# EAGLE design MXCHipConnector (EAGLE 9.3.2)
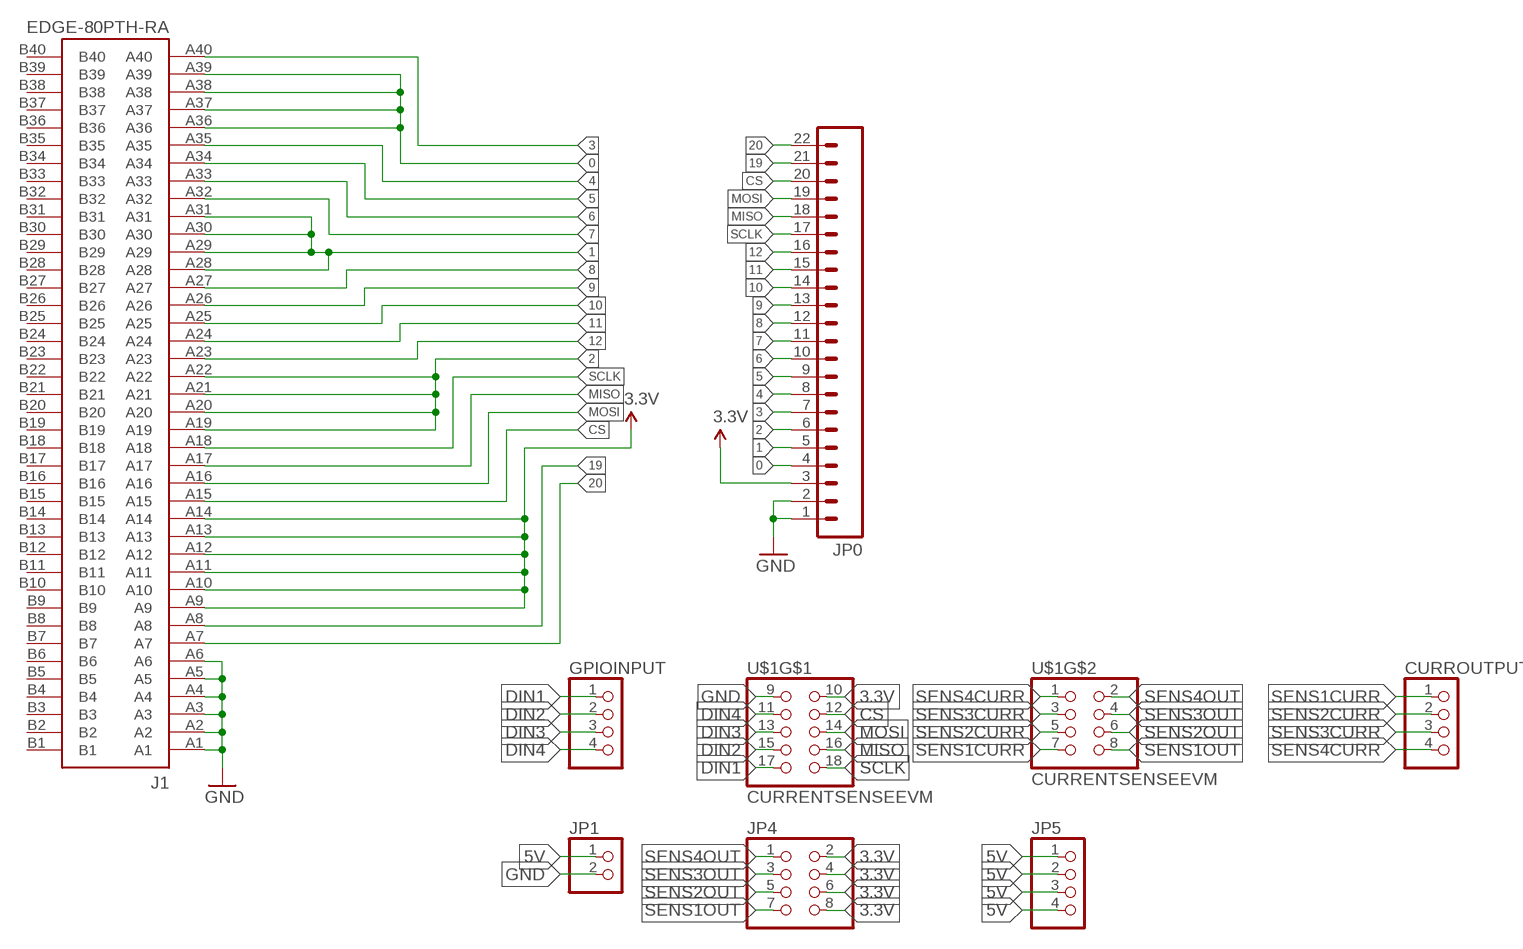
[diagram p0: schematic, sheet 1]

## Parts
CURROUTPUT  PINHD-1X4  [1X04]
GPIOINPUT  PINHD-1X4  [1X04]
J1  EDGE-80PTH-RA  [VEC-127-080-R]
JP0  M22PTH  [1X22]
JP1  PINHD-1X2  [1X02]
JP4  PINHD-2X4  [2X04]
JP5  PINHD-1X4  [1X04]
U$1  CURRENTSENSEEVM  [CURRENTSENSEEVM]

## Nets
0: J1.A36 J1.A37 J1.A38 J1.A39 JP0.4
1: J1.A28 J1.A29 J1.A30 J1.A31 JP0.5
2: J1.A19 J1.A20 J1.A21 J1.A22 JP0.6
3: J1.A40 JP0.7
3.3V: J1.A9 J1.A10 J1.A11 J1.A12 J1.A13 J1.A14 JP0.3 JP4.2 JP4.4 JP4.6 JP4.8 U$1.10
4: J1.A35 JP0.8
5: J1.A34 JP0.9
5V: JP1.1 JP5.1 JP5.2 JP5.3 JP5.4
6: J1.A33 JP0.10
7: J1.A32 JP0.11
8: J1.A27 JP0.12
9: J1.A26 JP0.13
10: J1.A25 JP0.14
11: J1.A24 JP0.15
12: J1.A23 JP0.16
19: J1.A8 JP0.21
20: J1.A7 JP0.22
CS: J1.A15 JP0.20 U$1.12
DIN1: GPIOINPUT.1 U$1.17
DIN2: GPIOINPUT.2 U$1.15
DIN3: GPIOINPUT.3 U$1.13
DIN4: GPIOINPUT.4 U$1.11
GND: J1.A1 J1.A2 J1.A3 J1.A4 J1.A5 J1.A6 JP0.1 JP0.2 JP1.2 U$1.9
MISO: J1.A17 JP0.18 U$1.16
MOSI: J1.A16 JP0.19 U$1.14
SCLK: J1.A18 JP0.17 U$1.18
SENS1CURR: CURROUTPUT.1 U$1.7
SENS1OUT: JP4.7 U$1.8
SENS2CURR: CURROUTPUT.2 U$1.5
SENS2OUT: JP4.5 U$1.6
SENS3CURR: CURROUTPUT.3 U$1.3
SENS3OUT: JP4.3 U$1.4
SENS4CURR: CURROUTPUT.4 U$1.1
SENS4OUT: JP4.1 U$1.2
Unconnected: J1.B1 J1.B2 J1.B3 J1.B4 J1.B5 J1.B6 J1.B7 J1.B8 J1.B9 J1.B10 J1.B11 J1.B12 J1.B13 J1.B14 J1.B15 J1.B16 J1.B17 J1.B18 J1.B19 J1.B20 J1.B21 J1.B22 J1.B23 J1.B24 J1.B25 J1.B26 J1.B27 J1.B28 J1.B29 J1.B30 J1.B31 J1.B32 J1.B33 J1.B34 J1.B35 J1.B36 J1.B37 J1.B38 J1.B39 J1.B40

## Library data of the parts
CURROUTPUT GPIOINPUT JP5 = pinhead-currentsense:PINHD-1X4: PIN HEADER
J1 = local_lib:EDGE-80: Card edge connector (80 pin) for accepting a PCB with finger edge pins. This connector will accept the BBC micro:bit board.; PROD_ID: CONN-13452
JP0 = local_lib:M22: Standard 22-pin 0.1" header; PROD_ID: CONN-13453
JP1 = pinhead-currentsense:PINHD-1X2: PIN HEADER
JP4 = pinhead-currentsense:PINHD-2X4: PIN HEADER
U$1 = pinhead-currentsense:CURRENTSENSEEVM

## Board
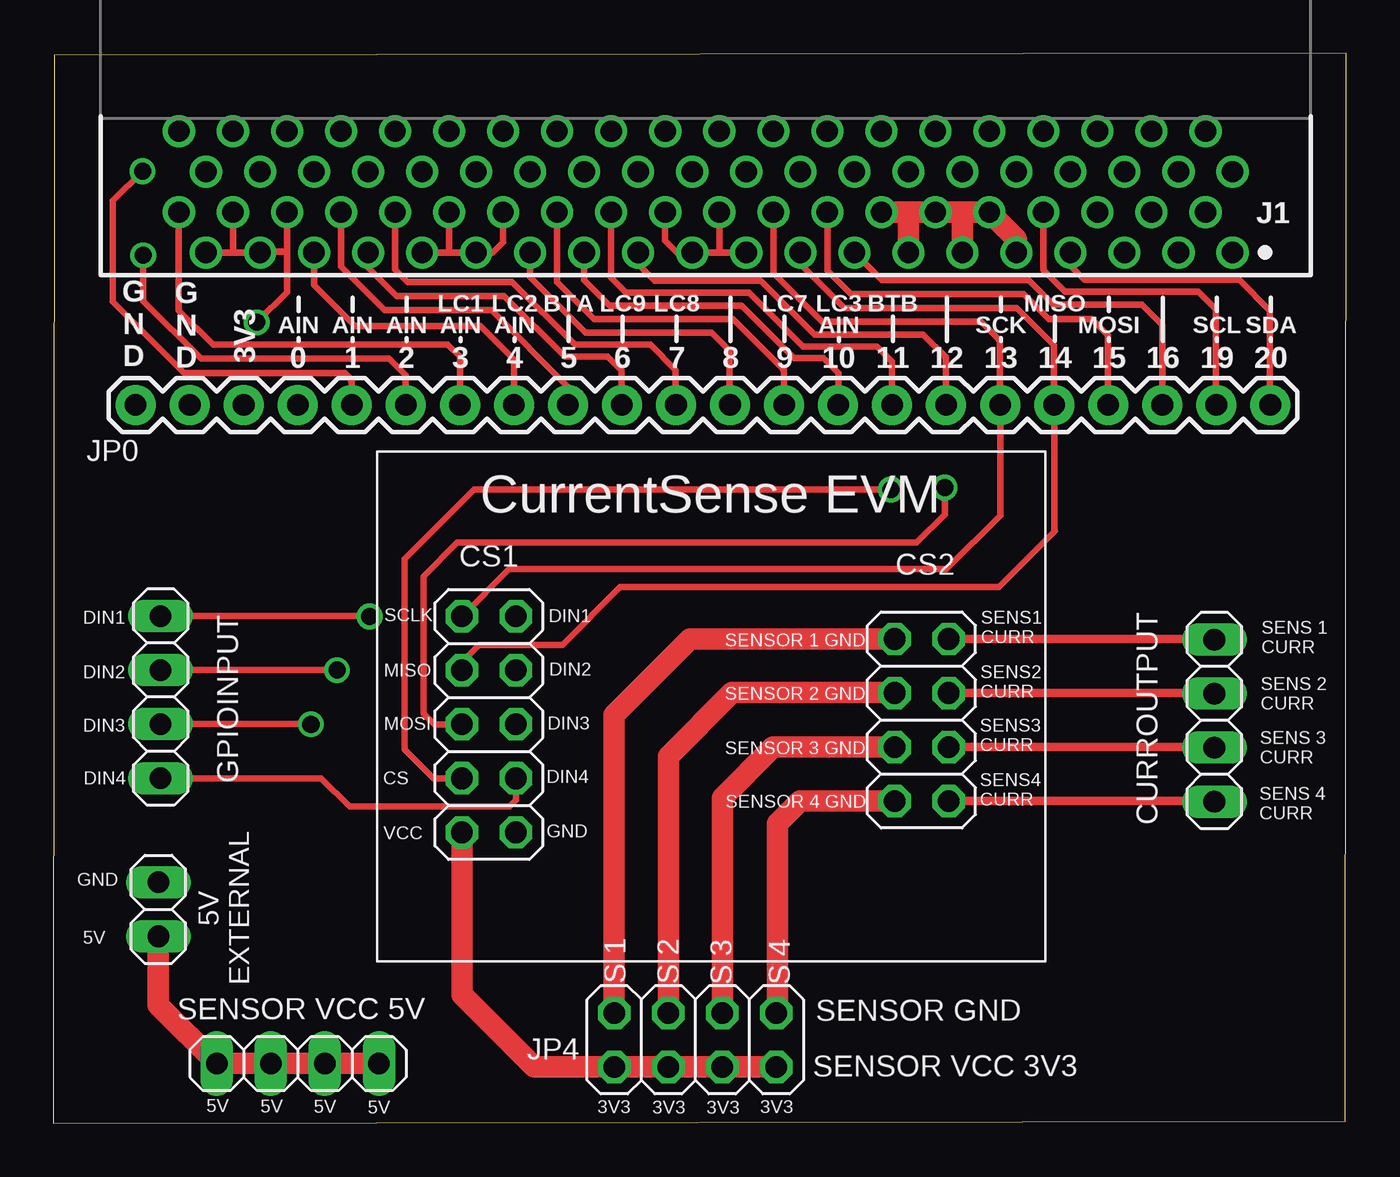
[diagram p1: board, top side]
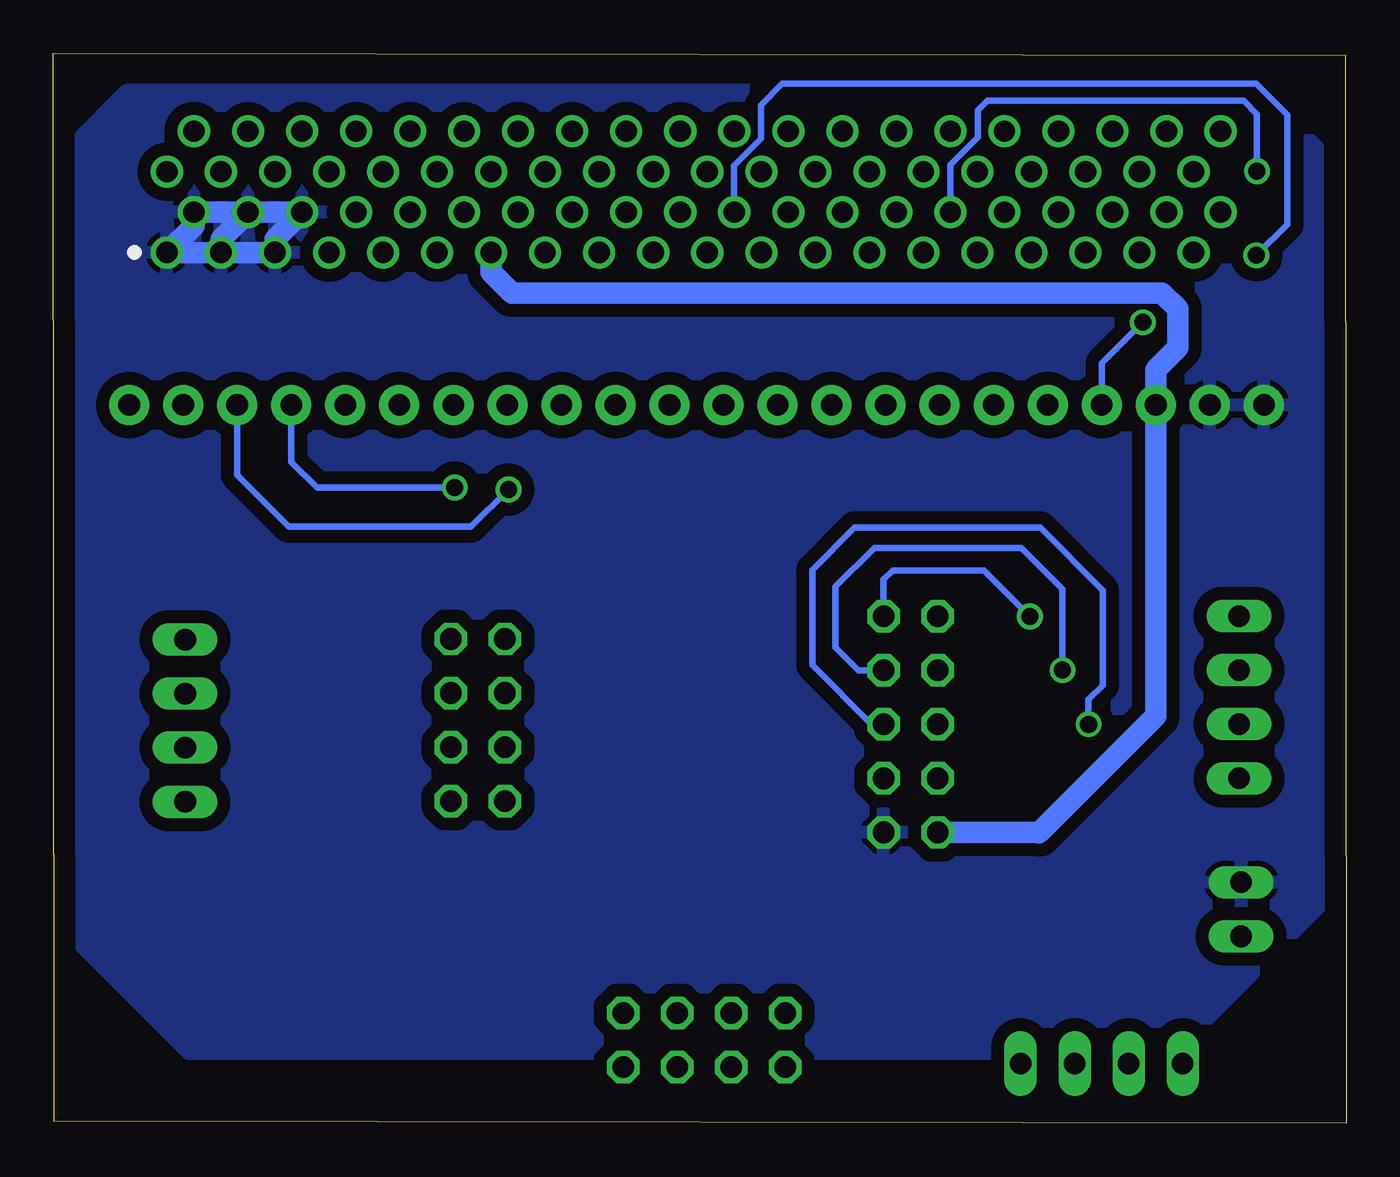
[diagram p2: board, bottom side, seen from below]

Size 60.79 x 50.32 mm. Coordinates in mm from the lower left corner, seen from the top.
Outline: 0,0 60.74,0.11 60.79,50.32 0.05,50.21 0,0
Copper layers (1*16): Top 0.035mm / dielectric 1.5mm / Bottom 0.035mm
Design rules "default *": minimum track width 6mil, minimum drill 0.35mm, track to track 10mil, track to pad 8mil, pad to pad 8mil, via to via 10mil, smd to smd 8mil, copper to edge 40mil, drill to drill 6mil, minimum pad ring 10mil, minimum via ring 8mil, stop-mask expansion 4mil, vias tented up to drill 0mil, thermal gap 10mil

### Footprints (pad centres in the part's own frame; a part is rotated, then mirrored left to right if it is on the bottom)
1X04 = drill 1.016 long: 1 -3.81,0; 2 -1.27,0; 3 1.27,0; 4 3.81,0
VEC-127-080-R = drill 1: A1 -24.765,0; A2 -23.495,-1.9; A3 -22.225,0; A4 -20.955,-1.9; A5 -19.685,0; A6 -18.415,-1.9; A7 -17.145,0; A8 -15.875,-1.9; A9 -14.605,0; A10 -13.335,-1.9; A11 -12.065,0; A12 -10.795,-1.9; A13 -9.525,0; A14 -8.255,-1.9; A15 -6.985,0; A16 -5.715,-1.9; A17 -4.445,0; A18 -3.175,-1.9; A19 -1.905,0; A20 -0.635,-1.9; A21 0.635,0; A22 1.905,-1.9; A23 3.175,0; A24 4.445,-1.9; A25 5.715,0; A26 6.985,-1.9; A27 8.255,0; A28 9.525,-1.9; A29 10.795,0; A30 12.065,-1.9; A31 13.335,0; A32 14.605,-1.9; A33 15.875,0; A34 17.145,-1.9; A35 18.415,0; A36 19.685,-1.9; A37 20.955,0; A38 22.225,-1.9; A39 23.495,0; A40 24.765,-1.9; B1 -24.765,-3.8; B2 -23.495,-5.7; B3 -22.225,-3.8; B4 -20.955,-5.7; B5 -19.685,-3.8; B6 -18.415,-5.7; B7 -17.145,-3.8; B8 -15.875,-5.7; B9 -14.605,-3.8; B10 -13.335,-5.7; B11 -12.065,-3.8; B12 -10.795,-5.7; B13 -9.525,-3.8; B14 -8.255,-5.7; B15 -6.985,-3.8; B16 -5.715,-5.7; B17 -4.445,-3.8; B18 -3.175,-5.7; B19 -1.905,-3.8; B20 -0.635,-5.7; B21 0.635,-3.8; B22 1.905,-5.7; B23 3.175,-3.8; B24 4.445,-5.7; B25 5.715,-3.8; B26 6.985,-5.7; B27 8.255,-3.8; B28 9.525,-5.7; B29 10.795,-3.8; B30 12.065,-5.7; B31 13.335,-3.8; B32 14.605,-5.7; B33 15.875,-3.8; B34 17.145,-5.7; B35 18.415,-3.8; B36 19.685,-5.7; B37 20.955,-3.8; B38 22.225,-5.7; B39 23.495,-3.8; B40 24.765,-5.7
1X22 = drill 1.016 pad 1.88: 1 0,0; 2 2.54,0; 3 5.08,0; 4 7.62,0; 5 10.16,0; 6 12.7,0; 7 15.24,0; 8 17.78,0; 9 20.32,0; 10 22.86,0; 11 25.4,0; 12 27.94,0; 13 30.48,0; 14 33.02,0; 15 35.56,0; 16 38.1,0; 17 40.64,0; 18 43.18,0; 19 45.72,0; 20 48.26,0; 21 50.8,0; 22 53.34,0
1X02 = drill 1.016 long: 1 -1.27,0; 2 1.27,0
2X04 = drill 1.016 octagon: 1 -3.81,-1.27; 2 -3.81,1.27; 3 -1.27,-1.27; 4 -1.27,1.27; 5 1.27,-1.27; 6 1.27,1.27; 7 3.81,-1.27; 8 3.81,1.27
CURRENTSENSEEVM = drill 1.016 octagon: 1 24.147,2.742; 2 21.607,2.742; 3 24.147,5.282; 4 21.607,5.282; 5 24.147,7.822; 6 21.607,7.822; 7 24.147,10.362; 8 21.607,10.362; 9 3.81,1.27; 10 1.27,1.27; 11 3.81,3.81; 12 1.27,3.81; 13 3.81,6.35; 14 1.27,6.35; 15 3.81,8.89; 16 1.27,8.89; 17 3.81,11.43; 18 1.27,11.43

### Placement (x,y rotation side)
CURROUTPUT  54.58,18.94 270 top
GPIOINPUT  5.05,20.04 270 top
J1  30.68,40.95 180 top
JP0  3.88,33.78 0 top
JP1  4.94,10.07 90 top
JP4  30.19,3.92 180 top
JP5  11.5,2.82 0 top
U$1  17.94,12.41 0 top

### Tracks (layer width: path | path; a pad name or v marks a point on that pad's centre or on a via)
0  (via drill 0.8)
  Top 0.305: J1.A39 8.44,40.95 | 8.44,40.95 J1.A37 9.76,40.98 10.99,40.98 | J1.A38 8.45,40.96 8.44,40.95 | v9.57,37.67 10.99,39.09 10.99,40.98 | 10.99,40.98 J1.A36
  Bottom 0.305: v9.57,37.67 11.5,35.74 JP0.4
1  (via drill 0.8)
  Top 0.305: 18.52,40.95 J1.A29 20.66,40.95 21.15,41.44 J1.A28 | 18.52,40.95 J1.A31 | J1.A30 18.61,41.04 18.52,40.95 | v4.2,44.77 2.81,43.38 2.81,38.63 6.17,35.28 13.72,35.28 14.04,34.96 | 14.04,34.96 14.05,34.95 14.02,34.92 | JP0.5 14.04,34.96
  Bottom 0.305: v4.2,44.77 4.2,47.44 4.83,48.07 16.87,48.07 17.31,47.62 17.31,46.36 18.6,45.07 18.6,42.85 J1.A30
2  (via drill 0.8)
  Top 0.305: 31.3,40.95 J1.A21 29.34,40.95 29.33,40.94 28.77,41.49 J1.A22 | 31.3,40.95 J1.A19 | J1.A20 31.31,40.96 31.3,40.95 | v4.23,40.81 4.23,38.67 6.95,35.95 15.79,35.95 16.56,35.18 | 16.56,35.18 | 16.56,35.18 16.56,33.8 JP0.6
  Bottom 0.305: v4.23,40.81 2.78,42.26 2.78,47.42 4.24,48.87 26.52,48.87 27.52,47.87 27.52,46.31 28.79,45.03 28.79,42.87 J1.A22
3
  Top 0.305: J1.A40 5.91,38.22 7.51,36.62 18.54,36.62 19.12,36.05 JP0.7
3.3V
  Top 1.016: J1.A14 40.27,42.85 | 40.27,42.85 J1.A12 42.7,42.85 | 42.7,42.85 J1.A10 45.28,41.58 J1.A9 | J1.A13 40.2,42.78 40.27,42.85 | J1.A11 42.74,42.81 42.7,42.85 | 19.18,13.65 U$1.10 19.21,6.04 22.6,2.66 JP4.8 JP4.6 JP4.4 JP4.2
  Bottom 1.016: J1.A13 40.2,40.02 39.22,39.04 8.66,39.04 7.93,38.3 7.93,36.48 8.94,35.46 8.93,35.45 8.96,35.42 JP0.3 8.96,19.16 14.45,13.67 14.47,13.68 U$1.10
4
  Top 0.305: J1.A35 12.26,39.41 14.19,37.48 20.09,37.48 21.64,35.94 | 21.64,35.94 21.66,35.92 JP0.8 | 21.63,35.93 21.64,35.94
5
  Top 0.305: J1.A34 13.53,40.27 15.58,38.23 20.6,38.23 24.18,34.65 24.17,34.64 24.17,33.81 JP0.9
5V
  Top 1.016: JP1.1 4.94,5.57 JP5.1 JP5.2 JP5.3 JP5.4
6
  Top 0.305: J1.A33 14.8,40.24 16.14,38.89 21.21,38.89 24.05,36.05 26.07,36.05 26.72,35.4 | 26.71,35.39 26.72,35.4 | 26.72,35.4 26.72,33.8 JP0.10
7
  Top 0.305: J1.A32 16.07,40.14 16.65,39.56 21.58,39.56 24.53,36.6 28.07,36.6 29.26,35.41 | 29.25,35.4 29.26,35.41 | 29.26,35.41 29.26,33.79 JP0.11
8
  Top 0.305: J1.A27 22.42,39.79 25.03,37.18 30.95,37.18 31.8,36.33 31.8,33.8 JP0.12
9
  Top 0.305: J1.A26 23.69,39.55 25.43,37.81 29.35,37.81 | 29.35,37.81 29.37,37.79 | 29.35,37.81 31.95,37.81 34.35,35.42 | 34.35,35.42 34.36,35.43 JP0.13 | 34.33,35.4 34.35,35.42
10
  Top 0.305: J1.A25 24.96,39.65 26.16,38.45 32.35,38.45 34.83,35.97 36.2,35.97 36.91,35.27 JP0.14
11
  Top 0.305: J1.A24 26.23,39.78 26.94,39.07 32.71,39.07 35.25,36.53 38.71,36.53 39.42,35.82 39.42,33.8 JP0.15
12
  Top 0.305: J1.A23 27.5,40.39 28.27,39.63 33.25,39.63 35.78,37.09 40.88,37.09 41.96,36.02 41.95,36.01 41.98,35.98 JP0.16
19
  Top 0.305: J1.A8 46.55,40.11 47.55,39.11 53.82,39.11 54.65,38.28 54.65,33.81 JP0.21
20
  Top 0.305: J1.A7 47.82,40.32 48.47,39.67 55.75,39.67 57.2,38.22 | 57.2,38.22 | 57.2,38.22 57.19,38.21 57.19,33.81 JP0.22
CS  (via drill 0.8)
  Top 0.305: J1.A15 38.96,39.64 45.87,39.64 47.02,38.49 51.17,38.49 52.14,37.53 JP0.20 | v39.38,29.8 19.79,29.8 16.52,26.53 16.52,17.58 17.87,16.22 U$1.12
  Bottom 0.305: JP0.20 52.14,30.48 49.71,28.05 41.13,28.05 v39.38,29.8 39.4,29.81
DIN1  (via drill 0.8)
  Top 0.305: GPIOINPUT.1 14.86,23.85 v14.88,23.84
  Bottom 0.305: U$1.17 21.75,25.57 21.32,26 17.04,26 v14.88,23.84
DIN2  (via drill 0.8)
  Top 0.305: GPIOINPUT.2 v13.34,21.31
  Bottom 0.305: U$1.15 22.94,21.3 24,22.37 24,25.23 22.18,27.06 15.27,27.06 13.34,25.13 v13.34,21.31
DIN3  (via drill 0.8)
  Top 0.305: GPIOINPUT.3 v12.11,18.77
  Bottom 0.305: U$1.13 22.31,18.76 25.1,21.55 25.1,26.03 23.12,28.01 14.39,28.01 11.45,25.07 11.45,20.59 12.11,19.93 v12.11,18.77
DIN4
  Top 0.305: GPIOINPUT.4 12.6,16.23 13.94,14.89 21.46,14.89 21.76,15.2 21.75,15.21 U$1.11
GND
  Bottom 1.016: J1.A4 J1.A6 50.36,41.58 J1.A5 J1.A3 | J1.A4 J1.A2 54.17,42.22 J1.A1 J1.A3 | J1.A4 52.9,41.58 J1.A3
  pour Bottom (isolate 0.61): 4.01,48.57 57.35,48.57 59.87,46.05 59.87,8.71 54.47,3.31 8.09,3.31 0.63,10.77 0.63,45.19
MISO
  Top 0.305: J1.A17 35.12,40.4 37.19,38.33 45.31,38.33 47.04,36.6 47.04,33.8 JP0.18 47.06,27.9 47.09,27.86 44.46,25.22 26.66,25.22 23.94,22.51 20.03,22.51 19.21,21.69 U$1.16
MOSI  (via drill 0.8)
  Top 0.305: J1.A16 36.39,40.09 37.49,38.99 45.64,38.99 46.81,37.81 48.83,37.81 49.58,37.06 | 49.57,37.05 49.58,37.06 | 49.58,37.06 49.58,33.8 JP0.19 | v41.91,29.89 41.91,28.63 40.59,27.31 19,27.31 17.4,25.72 17.4,19.28 17.93,18.75 17.95,18.76 U$1.14
  Bottom 0.305: JP0.19 49.6,31.1 48.39,29.89 42.83,29.89 v41.91,29.89
SCLK
  Top 0.305: J1.A18 33.85,39.98 36.13,37.7 43.62,37.7 44.51,36.8 | 44.51,36.8 44.49,36.78 | U$1.18 21.43,26.06 42,26.06 44.52,28.58 JP0.17 44.51,36.8
SENS1CURR
  Top 0.406: U$1.7 54.56,22.78 CURROUTPUT.1
SENS1OUT
  Top 1.016: JP4.7 26.38,19.21 29.94,22.78 U$1.8
SENS2CURR
  Top 0.406: U$1.5 54.56,20.24 CURROUTPUT.2
SENS2OUT
  Top 1.016: JP4.5 28.92,17.26 31.92,20.26 39.52,20.26 U$1.6
SENS3CURR
  Top 0.406: U$1.3 54.56,17.7 CURROUTPUT.3
SENS3OUT
  Top 1.016: JP4.3 31.46,15.31 33.85,17.7 U$1.4
SENS4CURR
  Top 0.406: U$1.1 54.56,15.16 CURROUTPUT.4
SENS4OUT
  Top 1.016: U$1.2 35.09,15.16 34.04,14.1 34.04,5.24 JP4.1

### Text on the board
tPlace: LC1 | LC2 | BTA | LC9 | LC8 | LC7 | LC3 | BTB | MISO | 3V3 | AIN | AIN | AIN | AIN | AIN | AIN | SCK | MOSI | SCL | SDA | G / N / D | G / N / D | 0 | 1 | 2 | 3 | 4 | 5 | 6 | 7 | 8 | 9 | 10 | 11 | 12 | 13 | 14 | 15 | 16 | 19 | 20 | CS1 | CS2
tNames: CurrentSense EVM | DIN1 | SENS 1 / CURR | DIN2 | SENS 2 / CURR | DIN3 | SENS 3 / CURR | DIN4 | SENS 4 / CURR | GND | 5V / EXTERNAL | 5V | S 1 | S 2 | S 3 | S 4 | SENSOR VCC 5V | SENSOR GND | SENSOR VCC 3V3 | 5V | 5V | 5V | 5V | 3V3 | 3V3 | 3V3 | 3V3